# EasyEDA Pro project STC电调.epro

# Schematic v1.0
Board Name: am32ai8051u; Create Date: 2026-01-19; Page Name: P1; Project Name: STC电调(AM32固件移植); Schematic Name: v1.0; Update Date: 2026-01-19; Company: 嘉立创EDA; Page Size: A4; Version: V1.0
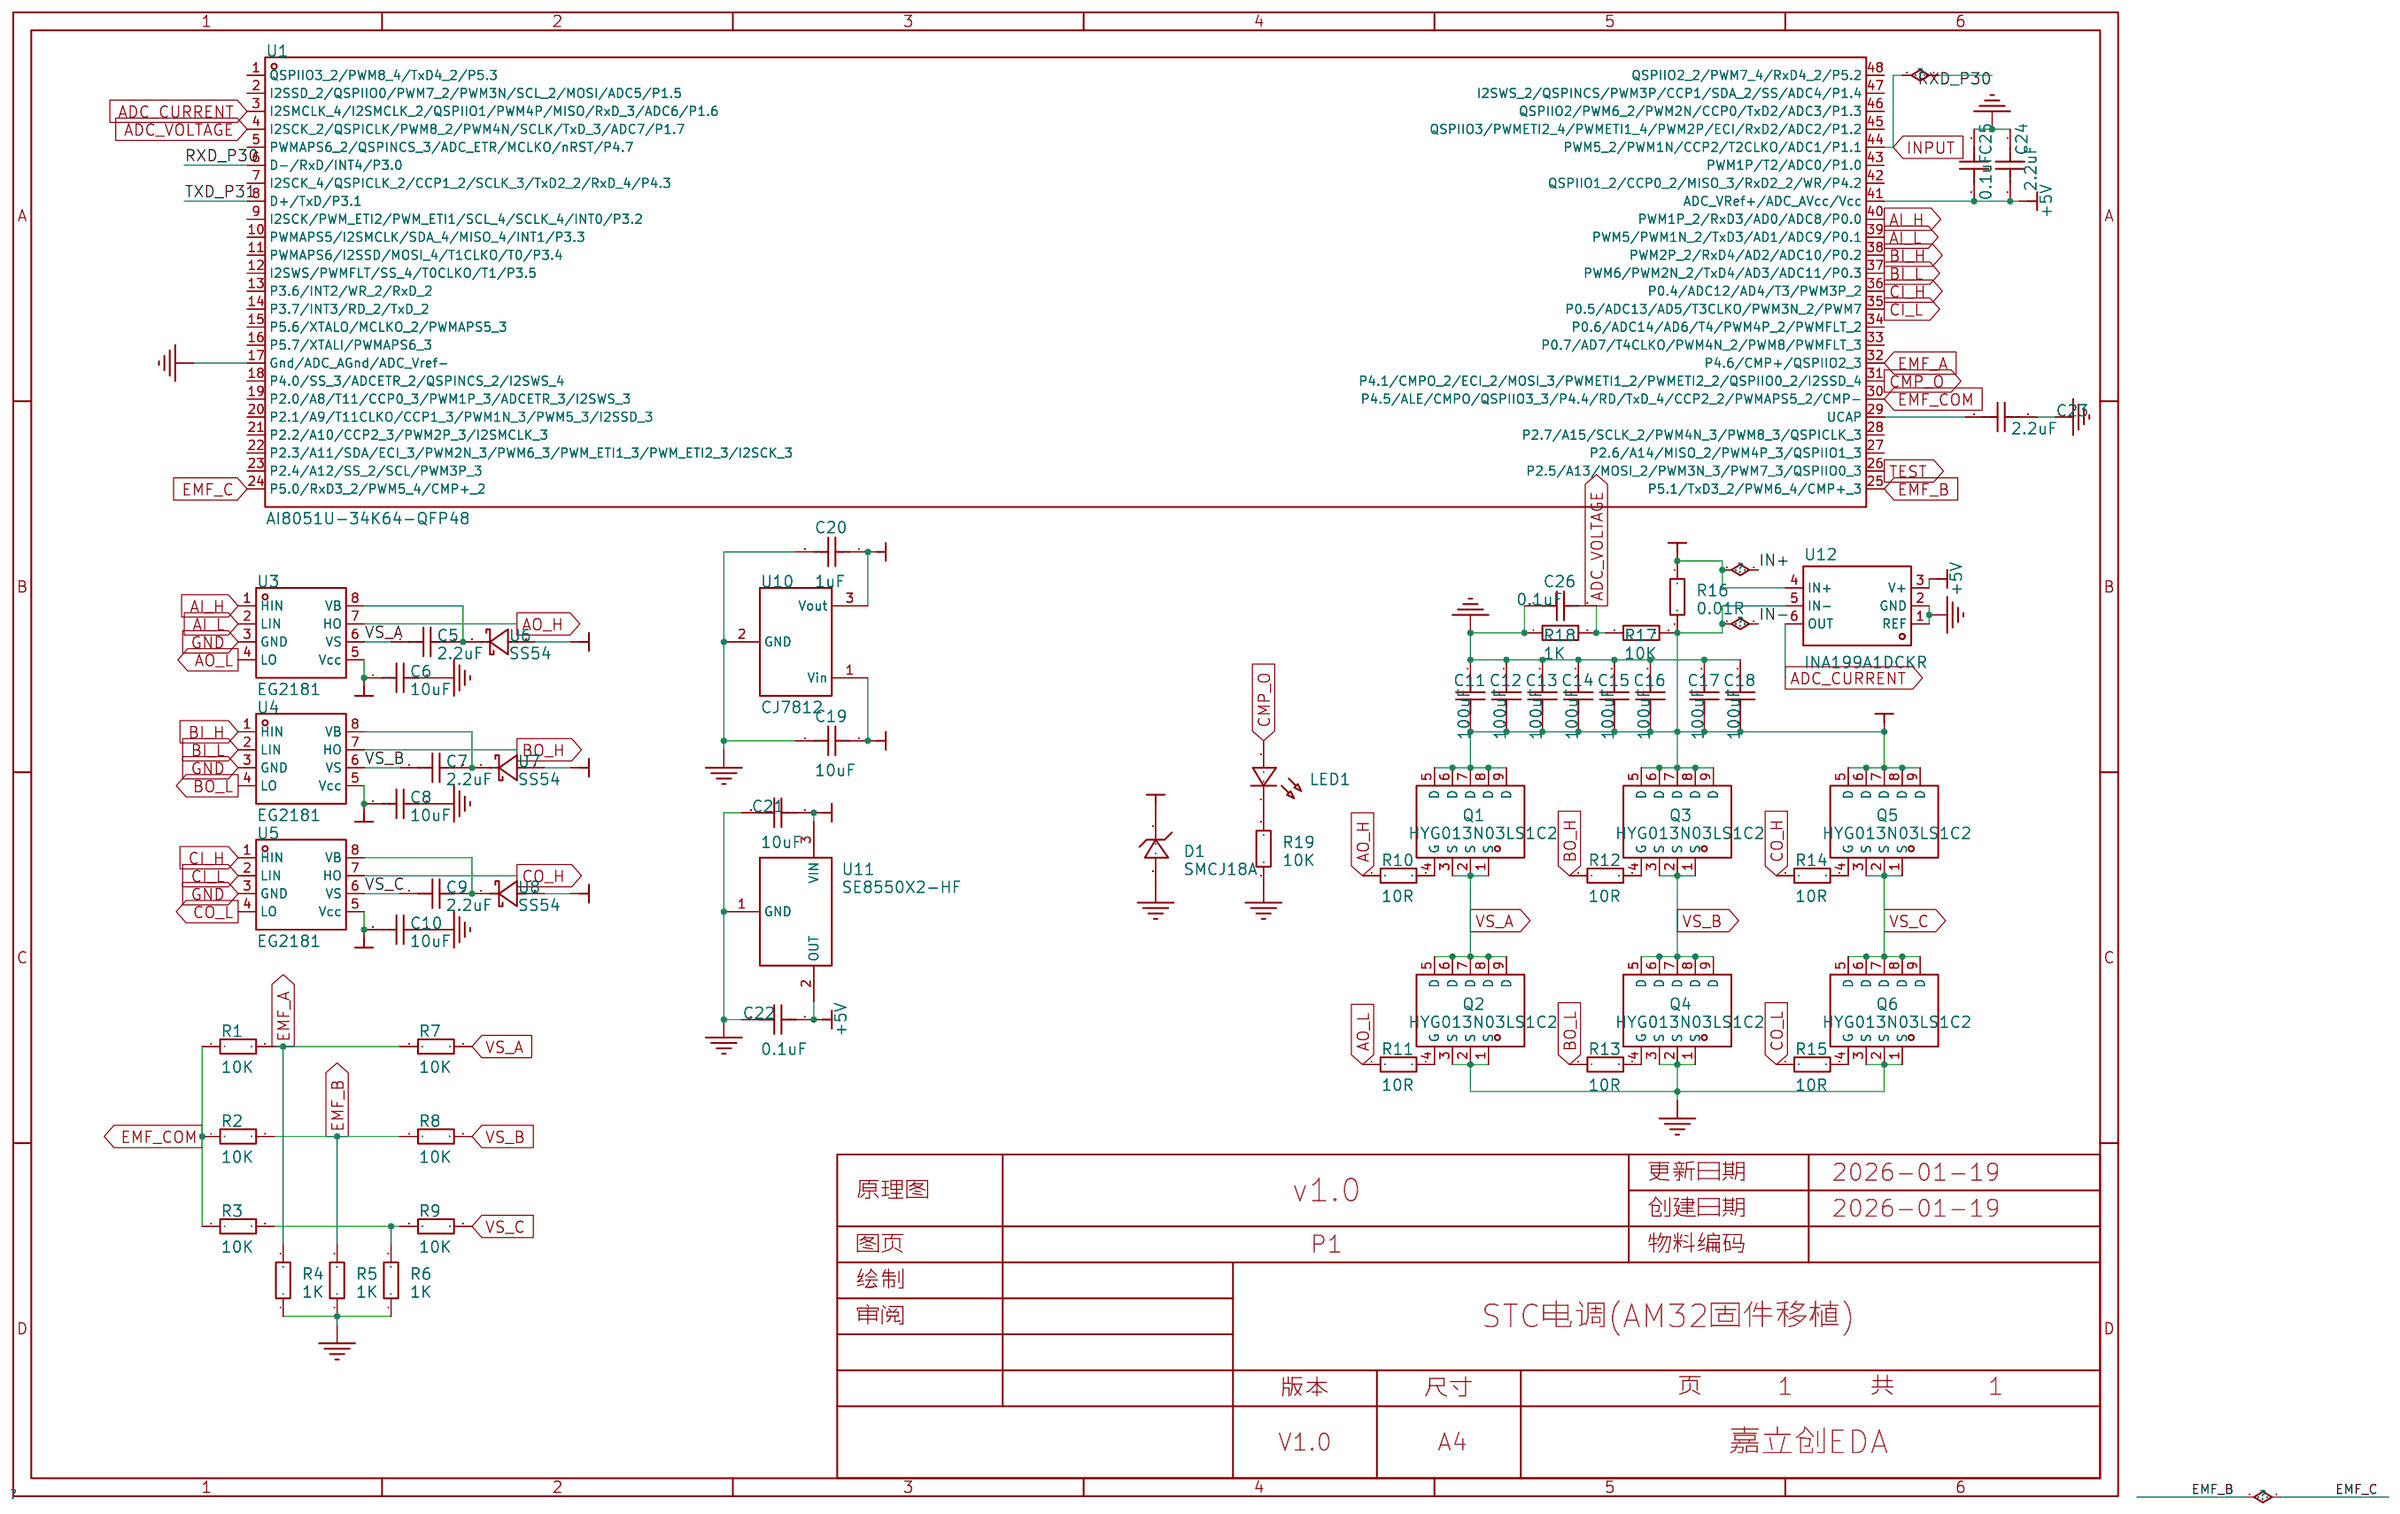
[diagram p0: schematic sheet]

## Parts
C5  2.2uF  [C0603]
C6  10uF  [C0603]
C7  2.2uF  [C0603]
C8  10uF  [C0603]
C9  2.2uF  [C0603]
C10  10uF  [C0603]
C11  100uF  [C1206]
C12  100uF  [C1206]
C13  100uF  [C1206]
C14  100uF  [C1206]
C15  100uF  [C1206]
C16  100uF  [C1206]
C17  100uF  [C1206]
C18  100uF  [C1206]
C19  10uF  [C0603]
C20  1uF  [C0603]
C21  10uF  [C0603]
C22  0.1uF  [C0603]
C23  2.2uF  [C0603]
C24  2.2uF  [C0603]
C25  0.1uF  [C0603]
C26  0.1uF  [C0603]
D1  SMCJ18A  [SMC_L6.9-W5.9-LS7.9-RD]
LED1  -  [LED_0603]
Q1  HYG013N03LS1C2  [PDFN-8_L5.8-W5.1-P1.27-LS6.1-BL]
Q2  HYG013N03LS1C2  [PDFN-8_L5.8-W5.1-P1.27-LS6.1-BL]
Q3  HYG013N03LS1C2  [PDFN-8_L5.8-W5.1-P1.27-LS6.1-BL]
Q4  HYG013N03LS1C2  [PDFN-8_L5.8-W5.1-P1.27-LS6.1-BL]
Q5  HYG013N03LS1C2  [PDFN-8_L5.8-W5.1-P1.27-LS6.1-BL]
Q6  HYG013N03LS1C2  [PDFN-8_L5.8-W5.1-P1.27-LS6.1-BL]
R1  10K  [R0603]
R2  10K  [R0603]
R3  10K  [R0603]
R4  1K  [R0603]
R5  1K  [R0603]
R6  1K  [R0603]
R7  10K  [R0603]
R8  10K  [R0603]
R9  10K  [R0603]
R10  10R  [R0603]
R11  10R  [R0603]
R12  10R  [R0603]
R13  10R  [R0603]
R14  10R  [R0603]
R15  10R  [R0603]
R16  0.01R  [R2010]
R17  10K  [R0603]
R18  1K  [R0603]
R19  10K  [R0603]
U1  AI8051U-34K64-QFP48  [LQFP-48_L7.0-W7.0-P0.50-LS9.0-BL_1]
U3  EG2181  [SOP-8_L4.9-W3.9-P1.27-LS6.0-BL]
U4  EG2181  [SOP-8_L4.9-W3.9-P1.27-LS6.0-BL]
U5  EG2181  [SOP-8_L4.9-W3.9-P1.27-LS6.0-BL]
U6  SS54  [SMA_L4.2-W2.6-LS5.1-RD]
U7  SS54  [SMA_L4.2-W2.6-LS5.1-RD]
U8  SS54  [SMA_L4.2-W2.6-LS5.1-RD]
U10  CJ7812  [TO-252-3_L6.5-W5.8-P4.58-BL]
U11  SE8550X2-HF  [SOT-23-3_L2.9-W1.3-P1.90-LS2.4-BR]
U12  INA199A1DCKR  [SC-70-6_L2.2-W1.3-P0.65-LS2.1-BR]

## Library data of the parts
C5-C10 C19-C26 = CAP_0603: Supplier Footprint: 0603
C11-C18 = CAP_1206: Supplier Footprint: 1206
D1 = SMCJ18A: LCSC Part Name: TVS 18V截止 51.4A峰值脉冲; Supplier Part: C374030; Manufacturer: Littelfuse(美国力特); Supplier Footprint: DO-214AB(SMCJ); JLCPCB Part Class: 扩展库; Datasheet: https://atta.szlcsc.com/upload/public/pdf/source/20190918/C428836_E6B4B3834ADA1E56164A3D12F904E6C7.pdf; Supplier: LCSC; polarity: 单向; Reverse Stand-Off Voltage (Vrwm): 18V; Maximum Clamping Voltage: 29.2V; Peak Pulse Current (Ipp): 51.4A; Peak Pulse Power Dissipation (Ppp): 1.5kW; Breakdown Voltage: 20V; Type: TVS
LED1 = LED_0603-R: Supplier Footprint: 0603
Q1-Q6 = HYG013N03LS1C2: LCSC Part Name: 单通道N沟道MOSFET,电流:150A,耐压:30V; Supplier Part: C2763405; Manufacturer: HUAYI(华羿微); Supplier Footprint: PDFN-8(5.1x5.8); JLCPCB Part Class: 扩展库; Datasheet: https://atta.szlcsc.com/upload/public/pdf/source/20210326/C2763405_0A6080D7BBB9C26F30CE39A27C6AD564.pdf; Supplier: LCSC; Drain Source Voltage (Vdss): 30V; Continuous Drain Current (Id): 150A; Drain Source On Resistance (RDS(on)@Vgs,Id): 2mΩ@4.5V,20A; Power Dissipation (Pd): 65W; Gate Threshold Voltage (Vgs(th)@Id): 1V@250uA; Total Gate Charge (Qg@Vgs): 44.7nC@10V; Input Capacitance (Ciss@Vds): 3.011nF; Reverse Transfer Capacitance (Crss@Vds): 9.2pF@25V; Operating Temperature: -55℃~+175℃
R1-R15 R17-R19 = Res_0603: Supplier Footprint: 0603
R16 = Res_2010: Supplier Footprint: 2010
U1 = AI8051U-34K64-QFP48: Supplier Part: C41427635; Manufacturer: STC; Supplier Footprint: QFP-48; JLCPCB Part Class: 扩展库; Datasheet: https://atta.szlcsc.com/upload/public/pdf/source/20241012/98E0A3F17C9CC280218AE3F266CCDE47.pdf; Supplier: LCSC
U3-U5 = EG2181: Supplier Part: C459721; Manufacturer: EG(屹晶微); Supplier Footprint: SOP-8; JLCPCB Part Class: 扩展库; Datasheet: https://atta.szlcsc.com/upload/public/pdf/source/20191122/C459721_8DDE7F395482F041919AB19A4C4FD510.pdf; Supplier: LCSC
U6-U8 = SS54: Supplier Part: C9900023219; Supplier Footprint: (1N5824)DO-214; JLCPCB Part Class: 扩展库; Supplier: LCSC
U10 = CJ7812_C26184: LCSC Part Name: 输入35V 输出12V 1.5A; Supplier Part: C26184; Manufacturer: CJ(江苏长电/长晶); Supplier Footprint: TO-252-2; JLCPCB Part Class: 扩展库; Datasheet: https://atta.szlcsc.com/upload/public/pdf/source/20180412/C26184_C7F45D4504ECDF2F14935BA96F015906.pdf; Supplier: LCSC; Output Type: 固定; Maximum Input Voltage: 35V; Output Voltage: 12V; Output Current: 1.5A; Dropout Voltage: 2V@(1A); Output Polarity: 正极; Number of Outputs: 1
U11 = SE8550X2-HF: LCSC Part Name: 输入40V 输出5V 250mA; Supplier Part: C115015; Manufacturer: SEAWARD(思旺); Supplier Footprint: SOT-23; JLCPCB Part Class: 扩展库; Datasheet: https://atta.szlcsc.com/upload/public/pdf/source/20221228/060EFB5038ABEFFCA582915343CD15E2.pdf; Supplier: LCSC; Output Type: 固定; Maximum Input Voltage: 40V; Output Voltage: 5V; MAX Output Current: 250mA; Power Supply Rejection Ratio (PSRR): 85dB; Dropout Voltage: 600mV@(200mA); standby current: 2uA; Output Polarity: 正极; Number of Outputs: 1
U12 = INA199A1DCKR: Supplier Part: C59135; Manufacturer: TI(德州仪器); Supplier Footprint: SOT-363(SC-70-6); JLCPCB Part Class: 扩展库; Datasheet: https://www.ti.com/cn/lit/gpn/ina199; Supplier: LCSC; Supply Voltage: -300mV~26V; Supply Current: 300uA; Operating Temperature: -40℃~+125℃

## Nets
+5V: C22.2 C24.2 C25.2 U1.41(ADC_VRef+/ADC_AVcc/Vcc) U11.2(OUT) U12.3(V+)
+12V: C6.1 C8.1 C10.1 C20.1 C21.1 U3.5(Vcc) U4.5(Vcc) U5.5(Vcc) U6.2(A) U7.2(A) U8.2(A) U10.3(Vout) U11.3(VIN)
GND: C6.2 C8.2 C10.2 C11.2 C12.2 C13.2 C14.2 C15.2 C16.2 C17.2 C18.2 C19.2 C20.2 C21.2 C22.1 C23.1 C24.1 C25.1 C26.1 D1.2(A) Q2.1(S) Q2.2(S) Q2.3(S) Q4.1(S) Q4.2(S) Q4.3(S) Q6.1(S) Q6.2(S) Q6.3(S) R4.1 R5.1 R6.1 R18.1 R19.1 U1.17(Gnd/ADC_AGnd/ADC_Vref-) U3.3(GND) U4.3(GND) U5.3(GND) U10.2(GND) U11.1(GND) U12.1(REF) U12.2(GND)
VBAT: C19.1 R16.1 U10.1(Vin) U12.4(IN+)
ADC_CURRENT: U1.3(I2SMCLK_4/I2SMCLK_2/QSPIIO1/PWM4P/MISO/RxD_3/ADC6/P1.6) U12.6(OUT)
ADC_VOLTAGE: C26.2 R17.1 R18.2 U1.4(I2SCK_2/QSPICLK/PWM8_2/PWM4N/SCLK/TxD_3/ADC7/P1.7)
AI_H: U1.40(PWM1P_2/RxD3/AD0/ADC8/P0.0) U3.1(HIN)
AI_L: U1.39(PWM5/PWM1N_2/TxD3/AD1/ADC9/P0.1) U3.2(LIN)
AO_H: R10.1 U3.7(HO)
AO_L: R11.1 U3.4(LO)
BI_H: U1.38(PWM2P_2/RxD4/AD2/ADC10/P0.2) U4.1(HIN)
BI_L: U1.37(PWM6/PWM2N_2/TxD4/AD3/ADC11/P0.3) U4.2(LIN)
BO_H: R12.1 U4.7(HO)
BO_L: R13.1 U4.4(LO)
CI_H: U1.36(P0.4/ADC12/AD4/T3/PWM3P_2) U5.1(HIN)
CI_L: U1.35(P0.5/ADC13/AD5/T3CLKO/PWM3N_2/PWM7) U5.2(LIN)
CMP_O: LED1.2(A) U1.31(P4.1/CMPO_2/ECI_2/MOSI_3/PWMETI1_2/PWMETI2_2/QSPIIO0_2/I2SSD_4)
CO_H: R14.1 U5.7(HO)
CO_L: R15.1 U5.4(LO)
EMF_A: R1.2 R4.2 R7.1 U1.32(P4.6/CMP+/QSPIIO2_3)
EMF_B: R2.2 R3.2 R5.2 R6.2 R8.1 R9.1 U1.24(P5.0/RxD3_2/PWM5_4/CMP+_2) U1.25(P5.1/TxD3_2/PWM6_4/CMP+_3)
EMF_COM: R1.1 R2.1 R3.1 U1.30(P4.5/ALE/CMPO/QSPIIO3_3/P4.4/RD/TxD_4/CCP2_2/PWMAPS5_2/CMP-)
INPUT: U1.6(D-/RxD/INT4/P3.0) U1.44(PWM5_2/PWM1N/CCP2/T2CLKO/ADC1/P1.1)
TEST: U1.26(P2.5/A13/MOSI_2/PWM3N_3/PWM7_3/QSPIIO0_3)
TXD_P31: U1.8(D+/TxD/P3.1)
V_MOS: C11.1 C12.1 C13.1 C14.1 C15.1 C16.1 C17.1 C18.1 D1.1(C) Q1.5(D) Q1.6(D) Q1.7(D) Q1.8(D) Q1.9(D) Q3.5(D) Q3.6(D) Q3.7(D) Q3.8(D) Q3.9(D) Q5.5(D) Q5.6(D) Q5.7(D) Q5.8(D) Q5.9(D) R16.2 R17.2 U12.5(IN-)
VS_A: C5.1 Q1.1(S) Q1.2(S) Q1.3(S) Q2.5(D) Q2.6(D) Q2.7(D) Q2.8(D) Q2.9(D) R7.2 U3.6(VS)
VS_B: C7.1 Q3.1(S) Q3.2(S) Q3.3(S) Q4.5(D) Q4.6(D) Q4.7(D) Q4.8(D) Q4.9(D) R8.2 U4.6(VS)
VS_C: C9.1 Q5.1(S) Q5.2(S) Q5.3(S) Q6.5(D) Q6.6(D) Q6.7(D) Q6.8(D) Q6.9(D) R9.2 U5.6(VS)
$1N3291: Q2.4(G) R11.2
$1N3317: Q4.4(G) R13.2
$1N3367: Q6.4(G) R15.2
$1N3393: Q1.4(G) R10.2
$1N3419: Q3.4(G) R12.2
$1N3445: Q5.4(G) R14.2
$1N6248: C7.2 U4.8(VB) U7.1(C)
$1N6352: C9.2 U5.8(VB) U8.1(C)
$1N7183: C23.2 U1.29(UCAP)
$1N9300: C5.2 U3.8(VB) U6.1(C)
$1N11107: LED1.1(C) R19.2

Not connected (* = marked no-connect by the designer): U1 1(QSPIIO3_2/PWM8_4/TxD4_2/P5.3) 2(I2SSD_2/QSPIIO0/PWM7_2/PWM3N/SCL_2/MOSI/ADC5/P1.5) 5(PWMAPS6_2/QSPINCS_3/ADC_ETR/MCLKO/nRST/P4.7) 7(I2SCK_4/QSPICLK_2/CCP1_2/SCLK_3/TxD2_2/RxD_4/P4.3) 9(I2SCK/PWM_ETI2/PWM_ETI1/SCL_4/SCLK_4/INT0/P3.2) 10(PWMAPS5/I2SMCLK/SDA_4/MISO_4/INT1/P3.3) 11(PWMAPS6/I2SSD/MOSI_4/T1CLKO/T0/P3.4) 12(I2SWS/PWMFLT/SS_4/T0CLKO/T1/P3.5) 13(P3.6/INT2/WR_2/RxD_2) 14(P3.7/INT3/RD_2/TxD_2) 15(P5.6/XTALO/MCLKO_2/PWMAPS5_3) 16(P5.7/XTALI/PWMAPS6_3) 18(P4.0/SS_3/ADCETR_2/QSPINCS_2/I2SWS_4) 19(P2.0/A8/T11/CCP0_3/PWM1P_3/ADCETR_3/I2SWS_3) 20(P2.1/A9/T11CLKO/CCP1_3/PWM1N_3/PWM5_3/I2SSD_3) 21(P2.2/A10/CCP2_3/PWM2P_3/I2SMCLK_3) 22(P2.3/A11/SDA/ECI_3/PWM2N_3/PWM6_3/PWM_ETI1_3/PWM_ETI2_3/I2SCK_3) 23(P2.4/A12/SS_2/SCL/PWM3P_3) 27(P2.6/A14/MISO_2/PWM4P_3/QSPIIO1_3) 28(P2.7/A15/SCLK_2/PWM4N_3/PWM8_3/QSPICLK_3) 33(P0.7/AD7/T4CLKO/PWM4N_2/PWM8/PWMFLT_3) 34(P0.6/ADC14/AD6/T4/PWM4P_2/PWMFLT_2) 42(QSPIIO1_2/CCP0_2/MISO_3/RxD2_2/WR/P4.2) 43(PWM1P/T2/ADC0/P1.0) 45(QSPIIO3/PWMETI2_4/PWMETI1_4/PWM2P/ECI/RxD2/ADC2/P1.2) 46(QSPIIO2/PWM6_2/PWM2N/CCP0/TxD2/ADC3/P1.3) 47(I2SWS_2/QSPINCS/PWM3P/CCP1/SDA_2/SS/ADC4/P1.4) 48(QSPIIO2_2/PWM7_4/RxD4_2/P5.2)

# Board v1.0
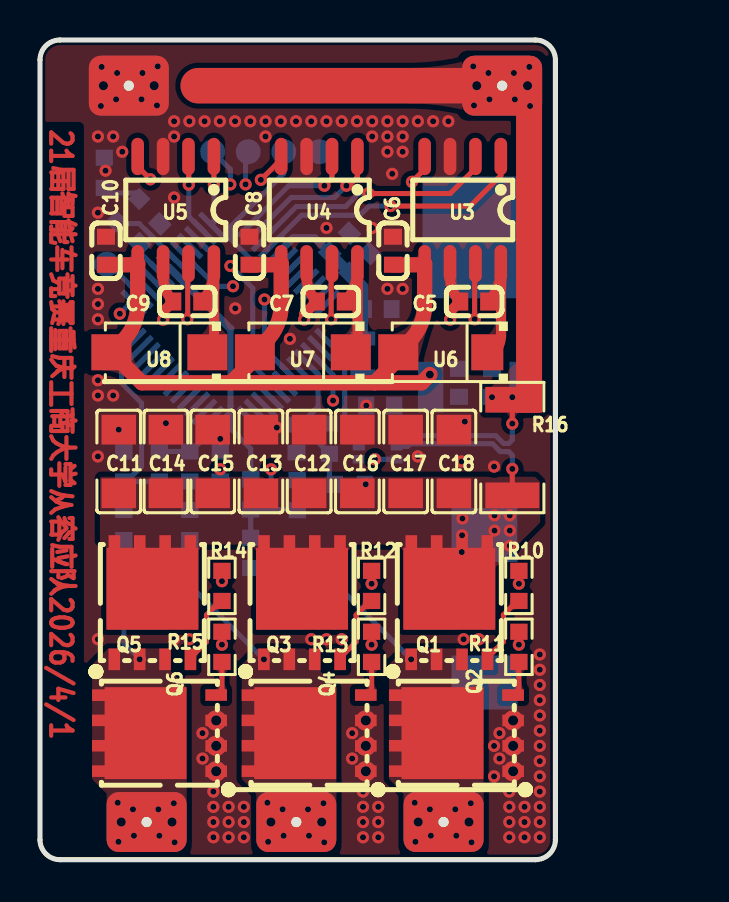
[diagram p1: board, top side]
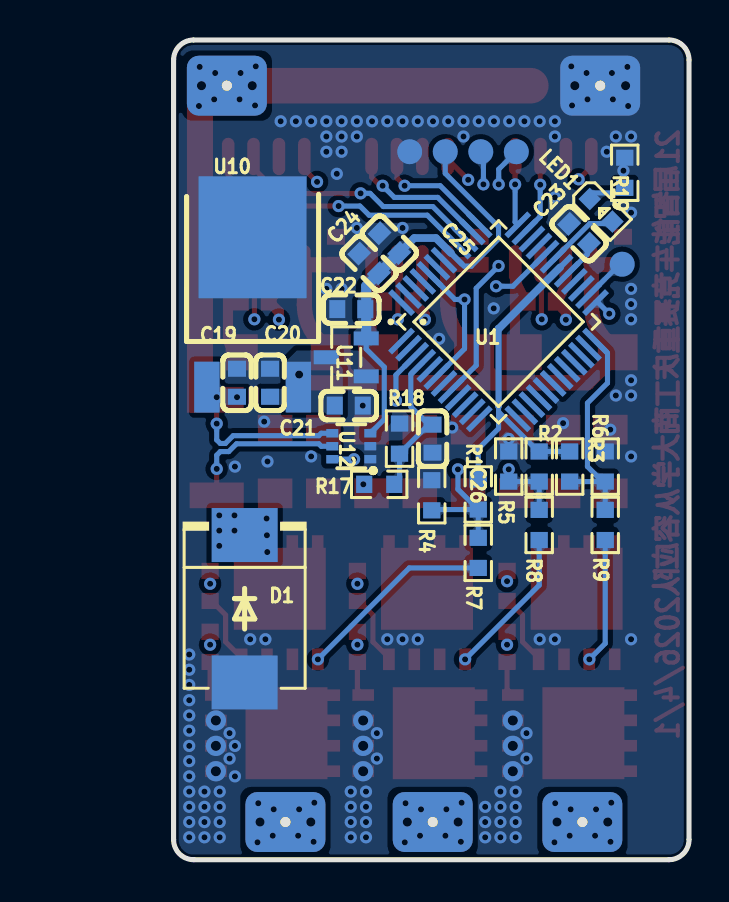
[diagram p2: board, bottom side, seen from below]

Outline 25.78 x 41 mm; copper layers: Top Layer, Inner1, Inner2, Bottom Layer. Coordinates in mm from the lower left corner of the outline.
Outline path: 0,40 0,1 arc(0.29,0.29) 1,0 24.78,0 arc(25.49,0.29) 25.78,1 25.78,40 arc(25.49,40.71) 24.78,41 1,41 arc(0.29,40.71) 0,40
Stack: Top Layer 0.035mm 外层铜厚1oz / Dielectric1 0.2104mm 7628 RC49% 8.6mil / Inner1 0.0152mm 内层铜厚 / Dielectric2 1.065mm 1.1mm H/HOZ Copper / Inner2 0.0152mm 内层铜厚 / Dielectric3 0.2104mm 7628 RC49% 8.6mil / Bottom Layer 0.035mm 外层铜厚1oz

## Design rules (mm)
spacing copperThickness1oz (default): track to track 0.102, other pairs 0.152 to 0.3
spacing copperThickness2oz: track to track 0.203, other pairs 0.152 to 0.3
spacing Plane_innerPlane: track to track 0.102, other pairs 0.152 to 0.3
spacing Copper_copperRegion: track to track 0.102, other pairs 0.152 to 0.3
track width copperThickness1oz (default): min 0.127, default 0.254, max 2.54
track width copperThickness2oz: min 0.203, default 0.254, max 2.54
differential pair differentialPair (default): width min 0.127, default 0.254, max 2.54; gap min 0.152, default 0.152
via viaSize (default): diameter min 0.5, default 0.61, max 10; hole min 0.3, default 0.305, max 6.299
pour e518 uses Copper_copperRegion
pour e520 uses Copper_copperRegion
pour e522 uses Copper_copperRegion
pour e524 uses Copper_copperRegion
pour e526 uses Copper_copperRegion
pour e528 uses Copper_copperRegion
pour e530 uses Copper_copperRegion
pour e532 uses Copper_copperRegion
pour e534 uses Copper_copperRegion
pour e536 uses Copper_copperRegion
pour e538 uses Copper_copperRegion
pour e540 uses Copper_copperRegion
pour e544 uses Copper_copperRegion
pour e546 uses Copper_copperRegion
pour e550 uses Copper_copperRegion

## Placement (name value [footprint] x y rotation side)
C5  2.2uF  [C0603]  21.72 27.92 0 top
C6  10uF  [C0603]  17.65 30.46 90 top
C7  2.2uF  [C0603]  14.54 27.92 0 top
C8  10uF  [C0603]  10.48 30.46 90 top
C9  2.2uF  [C0603]  7.37 27.92 0 top
C10  10uF  [C0603]  3.3 30.46 90 top
C11  100uF  [C1206]  3.94 19.92 90 top
C12  100uF  [C1206]  13.46 19.92 90 top
C13  100uF  [C1206]  11.05 19.92 90 top
C14  100uF  [C1206]  6.3 19.92 90 top
C15  100uF  [C1206]  8.64 19.92 90 top
C16  100uF  [C1206]  15.88 19.92 90 top
C17  100uF  [C1206]  18.29 19.92 90 top
C18  100uF  [C1206]  20.7 19.92 90 top
C19  10uF  [C0603]  22.61 23.85 90 bottom
C20  1uF  [C0603]  20.96 23.85 90 bottom
C21  10uF  [C0603]  17.02 22.71 180 bottom
C22  0.1uF  [C0603]  16.89 27.54 180 bottom
C23  2.2uF  [C0603]  5.5 31.31 225 bottom
C24  2.2uF  [C0603]  16 29.82 225 bottom
C25  0.1uF  [C0603]  14.99 30.84 225 bottom
C26  0.1uF  [C0603]  12.83 21.06 90 bottom
D1  SMCJ18A  [SMC_L6.9-W5.9-LS7.9-RD]  22.22 12.55 270 bottom
LED1  -  [LED_0603]  4.36 32.45 225 bottom
NOREF  -  [Pad_e227]  24.46 30.35 180 top
NOREF#2  -  [Pad_e225]  12.19 35.41 180 top
NOREF#3  -  [Pad_e220]  5.33 1.88 0 top
NOREF#4  -  [Pad_e222]  20.19 1.88 0 top
NOREF#5  -  [Pad_e223]  8.64 35.41 180 top
NOREF#6  -  [Pad_e219]  3.34 29.78 180 top
NOREF#7  -  [Pad_e224]  10.41 35.41 180 top
NOREF#8  -  [Pad_e221]  12.82 1.88 0 top
NOREF#9  -  [Pad_e226]  13.97 35.41 180 top
NOREF#10  -  [Pad_e228]  4.44 38.71 180 top
NOREF#11  -  [Pad_e229]  23.11 38.71 0 top
Q1  HYG013N03LS1C2  [PDFN-8_L5.8-W5.1-P1.27-LS6.1-BL]  20.47 12.86 0 top
Q2  HYG013N03LS1C2  [PDFN-8_L5.8-W5.1-P1.27-LS6.1-BL]  20.83 6.33 90 top
Q3  HYG013N03LS1C2  [PDFN-8_L5.8-W5.1-P1.27-LS6.1-BL]  13.1 12.86 0 top
Q4  HYG013N03LS1C2  [PDFN-8_L5.8-W5.1-P1.27-LS6.1-BL]  13.46 6.33 90 top
Q5  HYG013N03LS1C2  [PDFN-8_L5.8-W5.1-P1.27-LS6.1-BL]  5.62 12.86 0 top
Q6  HYG013N03LS1C2  [PDFN-8_L5.8-W5.1-P1.27-LS6.1-BL]  5.98 6.33 90 top
R1  10K  [R0603]  10.54 18.27 270 bottom
R2  10K  [R0603]  7.49 19.66 270 bottom
R3  10K  [R0603]  5.97 19.66 270 bottom
R4  1K  [R0603]  12.87 18.23 270 bottom
R5  1K  [R0603]  9.02 19.66 270 bottom
R6  1K  [R0603]  4.19 19.66 270 bottom
R7  10K  [R0603]  10.54 15.35 270 bottom
R8  10K  [R0603]  7.49 16.74 270 bottom
R9  10K  [R0603]  4.19 16.74 270 bottom
R10  10R  [R0603]  23.95 13.69 270 top
R11  10R  [R0603]  23.95 10.65 270 top
R12  10R  [R0603]  16.59 13.69 270 top
R13  10R  [R0603]  16.59 10.65 270 top
R14  10R  [R0603]  9.1 13.69 270 top
R15  10R  [R0603]  9.1 10.65 270 top
R16  0.01R  [R2010]  23.62 20.62 270 top
R17  10K  [R0603]  15.49 18.77 0 bottom
R18  1K  [R0603]  14.48 21.06 270 bottom
R19  10K  [R0603]  3.21 34.36 270 bottom
U1  AI8051U-34K64-QFP48  [LQFP-48_L7.0-W7.0-P0.50-LS9.0-BL_1]  9.53 26.9 225 bottom
U3  EG2181  [SOP-8_L4.9-W3.9-P1.27-LS6.0-BL]  21.14 32.49 180 top
U4  EG2181  [SOP-8_L4.9-W3.9-P1.27-LS6.0-BL]  13.97 32.49 180 top
U5  EG2181  [SOP-8_L4.9-W3.9-P1.27-LS6.0-BL]  6.79 32.49 180 top
U6  SS54  [SMA_L4.2-W2.6-LS5.1-RD#2]  20.32 25.38 180 top
U7  SS54  [SMA_L4.2-W2.6-LS5.1-RD]  13.15 25.38 180 top
U8  SS54  [SMA_L4.2-W2.6-LS5.1-RD]  5.97 25.38 180 top
U10  CJ7812  [TO-252-3_L6.5-W5.8-P4.58-BL]  21.82 27.38 180 bottom
U11  SE8550X2-HF  [SOT-23-3_L2.9-W1.3-P1.90-LS2.4-BR]  17.15 25.12 180 bottom
U12  INA199A1DCKR  [SC-70-6_L2.2-W1.3-P0.65-LS2.1-BR]  16.89 20.68 180 bottom

## Footprints (pads in the part's own frame, mm; a bottom-side part is the same pattern mirrored in y, then rotated)
C0603
  rect 0.8x0.9 smd: 1(-0.7,0) 2(0.7,0)
C1206
  rect 1.485x1.728 smd: 1(-1.593,0) 2(1.593,0)
LED_0603
  rect 0.8x0.8 smd: 1(-0.851,-0.01) 2(0.75,-0.005)
LQFP-48_L7.0-W7.0-P0.50-LS9.0-BL_1
  rect 0.28x1.62 smd: 1(-2.75,-4.11) 2(-2.25,-4.11) 3(-1.75,-4.11) 4(-1.25,-4.11) 5(-0.75,-4.11) 6(-0.25,-4.11) 7(0.25,-4.11) 8(0.75,-4.11) 9(1.25,-4.11) 10(1.75,-4.11) 11(2.25,-4.11) 12(2.75,-4.11) 25(2.75,4.11) 26(2.25,4.11) 27(1.75,4.11) 28(1.25,4.11) 29(0.75,4.11) 30(0.25,4.11) 31(-0.25,4.11) 32(-0.75,4.11) 33(-1.25,4.11) 34(-1.75,4.11) 35(-2.25,4.11) 36(-2.75,4.11)
  rect 1.62x0.28 smd: 13(4.11,-2.75) 14(4.11,-2.25) 15(4.11,-1.75) 16(4.11,-1.25) 17(4.11,-0.75) 18(4.11,-0.25) 19(4.11,0.25) 20(4.11,0.75) 21(4.11,1.25) 22(4.11,1.75) 23(4.11,2.25) 24(4.11,2.75) 37(-4.11,2.75) 38(-4.11,2.25) 39(-4.11,1.75) 40(-4.11,1.25) 41(-4.11,0.75) 42(-4.11,0.25) 43(-4.11,-0.25) 44(-4.11,-0.75) 45(-4.11,-1.25) 46(-4.11,-1.75) 47(-4.11,-2.25) 48(-4.11,-2.75)
Pad_e219
  round 1.25 smd far side: 1(0,0)
Pad_e220
  rrect 4x3 hole 0.508: 1(0,0)
Pad_e221
  rrect 4x3 hole 0.508: 1(0,0)
Pad_e222
  rrect 4x3 hole 0.508: 1(0,0)
Pad_e223
  round 1.25 smd far side: 1(0,0)
Pad_e224
  round 1.25 smd far side: 1(0,0)
Pad_e225
  round 1.25 smd far side: 1(0,0)
Pad_e226
  round 1.25 smd far side: 1(0,0)
Pad_e227
  rect 1.3x16 smd: 1(0,0)
Pad_e228
  rrect 4x3 hole 0.508: 1(0,0)
Pad_e229
  rrect 4x3 hole 0.508: 1(0,0)
PDFN-8_L5.8-W5.1-P1.27-LS6.1-BL
  rect 0.58x1.079 smd: 1(-1.905,-2.834) 2(-0.635,-2.834) 3(0.635,-2.834) 4(1.905,-2.834)
  rect 0.58x1.08 smd: 5(1.9,2.834) 6(0.64,2.834) 7(-0.63,2.834) 8(-1.9,2.834)
  rect 4.6x4.1 smd: 9(0,0.695)
R0603
  rect 0.806x0.864 smd: 1(-0.753,0) 2(0.753,0)
R2010
  rect 1.282x2.7 smd: 1(-2.391,0) 2(2.391,0)
SC-70-6_L2.2-W1.3-P0.65-LS2.1-BR
  rect 0.6x0.42 smd: 1(0.95,-0.65) 2(0.95,0) 3(0.95,0.65) 4(-0.95,0.65) 5(-0.95,0) 6(-0.95,-0.65)
SMA_L4.2-W2.6-LS5.1-RD
  rect 2x1.8 smd: 1(-2.4,0) 2(2.4,0)
SMA_L4.2-W2.6-LS5.1-RD#2
  rect 1.6x1.8 smd: 1(-2.051,0)
  rect 2x1.8 smd: 2(2.4,0)
SMC_L6.9-W5.9-LS7.9-RD
  rect 2.7x3.3 smd: 1(-3.687,0) 2(3.687,0)
SOP-8_L4.9-W3.9-P1.27-LS6.0-BL
  oval 0.63x1.865 smd: 1(-1.905,-2.683) 2(-0.635,-2.683) 3(0.635,-2.683) 4(1.905,-2.683) 5(1.905,2.683) 6(0.635,2.683) 7(-0.635,2.683) 8(-1.905,2.683)
SOT-23-3_L2.9-W1.3-P1.90-LS2.4-BR
  rect 1.25x0.7 smd: 1(1,-0.95) 2(1,0.95) 3(-1,0)
TO-252-3_L6.5-W5.8-P4.58-BL
  rect 1.27x2.54 smd: 1(-2.288,-3.747) 3(2.288,-3.745)
  rect 5.4x6.1 smd: 2(-0.002,3.747)

## Nets
+5V: C22.2 C24.2 C25.2 NOREF#2.1 U1.41 U11.2 U12.3
+12V: C6.1 C8.1 C10.1 C20.1 C21.1 U3.5 U4.5 U5.5 U6.2 U7.2 U8.2 U10.3 U11.3
GND: C6.2 C8.2 C10.2 C11.2 C12.2 C13.2 C14.2 C15.2 C16.2 C17.2 C18.2 C19.2 C20.2 C21.2 C22.1 C23.1 C24.1 C25.1 C26.1 D1.2 NOREF#9.1 NOREF#10.1 Q2.1 Q2.2 Q2.3 Q4.1 Q4.2 Q4.3 Q6.1 Q6.2 Q6.3 R4.1 R5.1 R6.1 R18.1 R19.1 U1.17 U3.3 U4.3 U5.3 U10.2 U11.1 U12.1 U12.2
VBAT: C19.1 NOREF.1 NOREF#11.1 R16.1 U10.1 U12.4
ADC_CURRENT: U1.3 U12.6
ADC_VOLTAGE: C26.2 R17.1 R18.2 U1.4
AI_H: U1.40 U3.1
AI_L: U1.39 U3.2
AO_H: R10.1 U3.7
AO_L: R11.1 U3.4
BI_H: U1.38 U4.1
BI_L: U1.37 U4.2
BO_H: R12.1 U4.7
BO_L: R13.1 U4.4
CI_H: U1.36 U5.1
CI_L: U1.35 U5.2
CMP_O: LED1.2 U1.31
CO_H: R14.1 U5.7
CO_L: R15.1 U5.4
EMF_A: R1.2 R4.2 R7.1 U1.32
EMF_B: R2.2 R5.2 R8.1 U1.25
EMF_C: R3.2 R6.2 R9.1 U1.24
EMF_COM: R1.1 R2.1 R3.1 U1.30
INPUT: NOREF#7.1 U1.6 U1.44
TEST: NOREF#6.1 U1.26
TXD_P31: NOREF#5.1 U1.8
V_MOS: C11.1 C12.1 C13.1 C14.1 C15.1 C16.1 C17.1 C18.1 D1.1 Q1.5 Q1.6 Q1.7 Q1.8 Q1.9 Q3.5 Q3.6 Q3.7 Q3.8 Q3.9 Q5.5 Q5.6 Q5.7 Q5.8 Q5.9 R16.2 R17.2 U12.5
VS_A: C5.1 NOREF#4.1 Q1.1 Q1.2 Q1.3 Q2.5 Q2.6 Q2.7 Q2.8 Q2.9 R7.2 U3.6
VS_B: C7.1 NOREF#8.1 Q3.1 Q3.2 Q3.3 Q4.5 Q4.6 Q4.7 Q4.8 Q4.9 R8.2 U4.6
VS_C: C9.1 NOREF#3.1 Q5.1 Q5.2 Q5.3 Q6.5 Q6.6 Q6.7 Q6.8 Q6.9 R9.2 U5.6
$1N3291: Q2.4 R11.2
$1N3317: Q4.4 R13.2
$1N3367: Q6.4 R15.2
$1N3393: Q1.4 R10.2
$1N3419: Q3.4 R12.2
$1N3445: Q5.4 R14.2
$1N6248: C7.2 U4.8 U7.1
$1N6352: C9.2 U5.8 U8.1
$1N7183: C23.2 U1.29
$1N9300: C5.2 U3.8 U6.1
$1N11107: LED1.1 R19.2

Pads without a net: U1 1 2 5 7 9 10 11 12 13 14 15 16 18 19 20 21 22 23 27 28 33 34 42 43 45 46 47 48

## Via types
v1: diameter 0.61, hole 0.305, Top Layer to Bottom Layer, 198 vias
v2: diameter 1.016, hole 0.508, Top Layer to Bottom Layer, 9 vias
v3: diameter 1.016, hole 0.457, Top Layer to Bottom Layer, 10 vias
v4: diameter 0.61, hole 0.4, Top Layer to Bottom Layer, 1 via

## Routing (per net, layer and track width the routed paths; a pad name or vN(x,y) marks a point on that pad's centre or on a via; arc(x,y) is an arc through that point)
+5V: length 22.3
  Bottom Layer w0.254: NOREF#2.1 12.19,34.33 9.53,31.66 9.53,31.05 10.89,29.69 11.25,29.69 U1.41 ; U12.3 15.24,22.03 15.24,24.64 16.15,25.54 U11.2
  Bottom Layer w0.381: 14.49,30.34 13.74,31.09 12.66,31.09 U1.41
  Bottom Layer w0.508: 14.49,30.34 16.15,28.69 U11.2
+12V: length 40.1
  Top Layer w0.762: 17.92,25.26 U6.2 18.49,25.95 arc(19.04,26.78) 19.24,27.75 U3.5 arc(19.18,29.77) 19.12,29.76 17.65,29.76 ; 10.48,29.76 11.95,29.76 arc(12.01,29.77) U4.5 12.06,27.75 arc(11.87,26.78) 11.32,25.95 U7.2 10.91,25.22 9.55,23.85 ; 16.73,23.85 17.92,25.05 ; 16.73,23.85 9.55,23.85 ; 16.73,23.85 19.09,23.85 v4(19.5,24.27) ; 9.55,23.85 5.09,23.85 U8.2 4.14,25.95 arc(4.69,26.78) 4.89,27.75 U5.5 arc(4.83,29.77) 4.77,29.76 3.3,29.76
GND:
  vias: v1(2.9,36.17) v1(2.9,32.36) v1(2.9,28.55) v1(2.9,27.79) v1(2.9,27.03) v1(2.9,23.98) v1(2.9,23.22) v1(2.9,20.17) v1(2.9,11.03) v1(3.04,37.7) v1(3.08,39.65) v1(3.28,34.46) v1(3.66,36.17) v1(3.66,23.22) v1(3.86,39.35) v1(3.81,38.03) v1(3.94,21.51) v1(4.12,35.41) v1(5.13,39.35) v1(5.08,38.03) v1(5.85,37.73) v1(5.89,39.68) v1(6.3,21.83) v1(6.71,36.93) v1(6.71,36.17) v1(6.71,33.12) v1(6.71,11.03) v1(7.47,36.93) v1(7.47,11.03) v1(8.13,6.33) v1(8.13,5.06) v1(8.23,36.93) v1(8.67,3.41) v1(8.67,2.64) v1(8.67,1.88) v1(8.67,1.12) v1(8.99,36.93) v1(9.02,21.05) v1(9.43,3.41) v1(9.43,2.64) v1(9.43,1.88) v1(9.43,1.12) v1(9.76,36.93) v1(9.77,27.58) v1(10.19,2.64) v1(10.19,1.88) v1(10.19,1.12) v1(10.52,36.93) v1(11.28,36.93) v1(11.28,36.17) v1(11.84,21.61) v1(12.04,36.93) v1(12.5,26.05) v1(12.8,36.93) v1(13.57,36.93) v1(13.57,11.03) v1(14.33,36.93) v1(14.33,31.6) v1(14.33,11.03) v1(15.09,36.93) v1(15.09,11.03) v1(15.61,6.33) v1(15.61,5.06) v1(15.85,36.93) v1(16.16,3.41) v1(16.16,2.64) v1(16.16,1.88) v1(16.16,1.12) v1(16.32,22.71) v1(16.61,36.93) v1(16.61,36.17) v1(16.61,31.6) v1(16.92,3.41) v1(16.92,2.64) v1(16.92,1.88) v1(16.92,1.12) v1(17.38,36.93) v1(17.38,36.17) v1(17.38,35.41) v1(17.38,28.55) v1(17.62,34.31) v1(18.14,36.93) v1(18.14,36.17) v1(18.14,35.41) v1(18.14,28.55) v1(18.9,36.93) v1(18.9,20.17) v1(19.66,36.93) v1(20.42,36.93) v1(21.08,19.92) v1(21.25,21.91) v1(21.19,11.03) v1(21.95,11.03) v1(22.71,19.66) v1(22.71,5.69) v1(22.71,4.17) v1(22.98,6.33) v1(22.98,5.06) v1(23.47,3.41) v1(23.47,2.64) v1(23.47,1.88) v1(23.47,1.12) v1(24.23,3.41) v1(24.23,2.64) v1(24.23,1.88) v1(24.23,1.12) v1(25,10.26) v1(25,9.5) v1(25,8.74) v1(25,7.98) v1(25,7.22) v1(25,6.45) v1(25,5.69) v1(25,4.93) v1(25,4.17) v1(25,3.41) v1(25,2.64) v1(25,1.88) v1(25,1.12) v2(8.81,6.96) v2(8.81,5.69) v2(8.81,4.42) v2(16.3,6.96) v2(16.3,5.69) v2(16.3,4.42) v2(23.66,6.96) v2(23.66,5.69) v2(23.66,4.42) v3(3.17,38.71) v3(5.71,38.71)
VBAT: length 23.4
  Top Layer w0.254: v1(23.62,23.13) v1(23.62,21.81)
  Top Layer w1.524: v3(21.84,38.71) NOREF#11.1
  Top Layer w1.778: 7.91,38.71 v3(21.84,38.71)
  Bottom Layer w0.254: v1(23.62,21.81) 23.62,21 23.44,20.82 23.19,20.82 22.8,21.21 18.52,21.21 18.4,21.33 U12.4
  vias: v1(21.67,39.68) v1(21.71,37.73) v1(22.43,39.35) v1(22.48,38.03) v1(22.61,23.13) v1(23.7,39.35) v1(23.75,38.03) v1(24.47,39.65) v1(24.51,37.7) v3(24.38,38.71)
ADC_CURRENT: length 7.6
  Inner2 w0.381: v1(14.66,22.97) 14.66,22.12 v1(16.75,20.03)
  Bottom Layer w0.254: v1(14.66,22.97) 14.66,24.25 U1.3 ; U12.6 v1(16.75,20.03)
ADC_VOLTAGE: length 7.6
  Bottom Layer w0.254: 13.02,21.76 C26.2 ; 13.02,21.76 13.02,21.76 R18.2 14.48,19.04 R17.1 ; 13.02,21.76 13.91,22.65 13.91,24.28 U1.4
AI_H: length 13.9
  Top Layer w0.254: U3.1 23.05,34.22 21.52,32.69 v1(17.53,32.69)
  Bottom Layer w0.254: 11.55,30.69 13.09,32.24 16,32.24 16.46,32.69 v1(17.53,32.69)
AI_L: length 12.6
  Top Layer w0.254: v1(16.43,33.33) 16.44,33.32 20.51,33.32 21.78,34.58 U3.2
  Bottom Layer w0.254: U1.39 12.82,32.67 15.29,32.67 15.95,33.33 v1(16.43,33.33)
AO_H: length 17.6
  Top Layer w0.254: v1(21.74,27.03) 21.74,29.77 U3.7 ; R10.1 v1(23.95,13.8)
  Inner2 w0.381: v1(21.74,27.03) 21.96,26.81 21.96,15.8 v1(23.95,13.8)
AO_L: length 28.1
  Top Layer w0.254: U3.4 19.24,34.54 v1(18.6,33.9) ; v1(23.95,10.75) R11.1
  Inner2 w0.381: v1(23.95,10.75) 24.6,11.4 24.6,25.08 18.6,31.08 v1(18.6,33.9)
BI_H: length 7.2
  Top Layer w0.254: 15.87,35.17 15.87,34.14 15.44,33.71 v1(15.32,33.71)
  Bottom Layer w0.254: v1(15.32,33.71) 14.74,33.13 12.57,33.13 U1.38
BI_L: length 6.2
  Top Layer w0.254: v1(14.22,33.71) 14.6,34.09 14.6,35.17
  Bottom Layer w0.254: v1(14.22,33.71) 12.44,33.71 U1.37
BO_H: length 18
  Top Layer w0.254: v1(14.56,27.03) 14.56,29.77 14.6,29.81 ; R12.1 v1(16.59,13.8)
  Inner2 w0.381: v1(16.59,13.8) 14.01,16.38 14.01,26.48 v1(14.56,27.03)
BO_L: length 29
  Top Layer w0.254: 12.06,35.17 12.06,34.9 11.94,34.9 v1(11.04,34.01) ; v1(16.59,10.75) R13.1
  Inner2 w0.381: v1(16.59,10.75) 17.95,12.11 17.95,25.21 11.04,32.11 v1(11.04,34.01)
CI_H: length 3.5
  Top Layer w0.254: 8.7,33.78 U5.1
  Bottom Layer w0.254: U1.36 8.7,31.89 8.7,33.78
  vias: v1(8.7,33.78)
CI_L: length 4.1
  Top Layer w0.254: U5.2 7.44,35.16 v1(7.44,33.76)
  Bottom Layer w0.254: U1.35 7.44,32.17 v1(7.44,33.76)
CMP_O: length 3.6
  Bottom Layer w0.254: 4.01,31.87 4.07,31.82 4.96,31.82 6.79,29.99
CO_H: length 17.1
  Top Layer w0.254: R14.1 v1(9.1,13.93) ; v1(7.37,27.03) 7.39,27.05 7.39,29.77 U5.7
  Inner2 w0.381: v1(7.37,27.03) 7.38,27.02 7.38,15.65 v1(9.1,13.93)
CO_L: length 27.6
  Top Layer w0.254: v1(5.52,34.03) 4.89,34.67 U5.4 ; v1(9.1,10.75) R15.1
  Inner2 w0.381: v1(5.52,34.03) 5.52,30.91 10.03,26.39 10.03,11.69 v1(9.1,10.75)
EMF_A: length 19.3
  Inner2 w0.381: v1(11.56,19.52) 10.96,20.12 10.96,27.37 v1(9.65,28.68)
  Bottom Layer w0.254: v1(9.65,28.68) 8.81,28.68 7.15,30.34 ; v1(11.56,19.52) 11.56,18.53 R1.2 ; R1.2 12.83,17.51 R4.2 ; R1.2 R7.1
EMF_B: length 17.1
  Inner2 w0.381: v1(9.02,19.52) 8.76,19.78 8.75,19.78 8.17,20.37 8.17,27.15 7.56,27.75 4.44,27.75 v1(3.99,27.31)
  Bottom Layer w0.254: U1.25 4.55,27.86 v1(3.99,27.31) ; R8.1 R2.2 R5.2 v1(9.02,19.52)
EMF_C: length 11.3
  Bottom Layer w0.254: 4.33,18.91 R6.2 4.19,17.75 4.44,17.5 ; 4.33,18.91 R3.2 ; 4.33,18.91 5.08,19.66 5.08,22.84 4.08,23.84 4.08,25.34 U1.24
EMF_COM: length 16.7
  Bottom Layer w0.254: R1.1 10.54,20.55 9.53,21.57 9.53,22.4 ; 9.53,22.4 7.54,20.42 R2.1 R3.1 ; 9.53,22.4 9.53,22.66 9.54,22.66
  Bottom Layer w0.305: 9.54,22.66 9.53,22.68 9.53,26.55 9.54,26.56
  Bottom Layer w0.381: U1.30 9.51,26.56 9.54,26.56
INPUT: length 14.5
  Inner2 w0.254: v1(11.23,28.02) 10.28,28.96 10.28,33.76
  Bottom Layer w0.254: 10.28,33.76 10.28,35.28 NOREF#7.1 ; U1.6 11.23,25.55 v1(11.23,28.02) 11.7,28.02 12.96,29.28
  vias: v1(10.28,33.78)
TEST: length 2.4
  Bottom Layer w0.254: 3.3,29.76 3.49,29.76 U1.26
TXD_P31: length 13.3
  Inner2 w0.254: v1(9.53,29.7) 9.53,33.77 v1(9.52,33.78)
  Bottom Layer w0.254: v1(9.52,33.78) 9.52,34.53 NOREF#5.1 ; v1(9.53,29.7) 10.64,28.58 10.64,24.72 U1.8
V_MOS: length 8.1
  Top Layer w0.254: R16.2 v1(23.62,19.55)
  Bottom Layer w0.254: v1(23.62,19.55) 23.62,20.23 23.44,20.41 23.02,20.41 22.63,20.8 18.52,20.8 18.4,20.68 U12.5
  vias: v1(16.29,18.77) v1(21.13,17.07) v1(21.11,16.23) v1(21.09,15.39) v1(22.73,17.22) v1(22.73,16.46) v1(23.5,17.22) v1(23.5,16.46) v1(23.5,15.7)
VS_A: length 30.9
  Top Layer w0.508: v1(20.51,27.01) 20.51,27.41 21.02,27.92 arc(20.64,28.48) 20.51,29.15 U3.6
  Inner2 w0.508: v1(18.56,10.02) 20.21,11.67 20.21,26.71 v1(20.51,27.01)
  Bottom Layer w0.254: v1(18.56,10.02) 13.99,14.59 R7.2
  vias: v1(18.74,2.85) v1(18.78,0.9) v1(19.5,2.52) v1(19.55,1.2) v1(20.77,2.52) v1(20.82,1.2) v1(21.54,2.82) v1(21.58,0.87) v3(18.91,1.88) v3(21.46,1.88)
VS_B: length 28.5
  Top Layer w0.508: v1(13.21,27.01) 13.21,27.28 C7.1 arc(13.47,28.48) 13.34,29.15 U4.6
  Inner2 w0.508: v1(11.2,10.02) 13.21,12.03 v1(13.21,27.01)
  Bottom Layer w0.254: v1(11.2,10.02) 7.49,13.73 R8.2
  vias: v1(11.37,2.85) v1(11.41,0.9) v1(12.13,2.52) v1(12.18,1.2) v1(13.4,2.52) v1(13.45,1.2) v1(14.18,2.82) v1(14.22,0.87) v3(11.55,1.88) v3(14.09,1.88)
VS_C: length 26.9
  Top Layer w0.508: U5.6 6.16,29.15 arc(6.29,28.48) C9.1 6.16,27.41 v1(6.16,27.01)
  Inner2 w0.508: v1(6.16,27.01) 5.59,26.44 5.59,10.62 v1(4.98,10.02)
  Bottom Layer w0.254: R9.2 4.19,10.82 v1(4.98,10.02)
  vias: v1(3.89,2.85) v1(3.93,0.9) v1(4.65,2.52) v1(4.7,1.2) v1(5.92,2.52) v1(5.97,1.2) v1(6.69,2.82) v1(6.73,0.87) v3(4.06,1.88) v3(6.6,1.88)
$1N3291: length 1.8
  Top Layer w0.254: Q2.4 23.95,8.52 R11.2
$1N3317: length 1.8
  Top Layer w0.254: R13.2 16.59,8.52 Q4.4
$1N3367: length 1.8
  Top Layer w0.254: Q6.4 9.1,8.52 R15.2
$1N3393: length 3.6
  Top Layer w0.254: Q1.4 22.38,10.1 23.18,10.9 23.18,12.24 23.88,12.94 R10.2
$1N3419: length 3.6
  Top Layer w0.254: R12.2 16.51,12.94 15.81,12.24 15.81,10.9 15.01,10.1 Q3.4
$1N3445: length 3.6
  Top Layer w0.254: R14.2 9.03,12.94 8.33,12.24 8.33,10.9 7.53,10.1 Q5.4
$1N6248: length 6.2
  Top Layer w0.508: U4.8 15.88,29.44 ; 15.88,29.44 15.89,29.43 15.89,26.18 15.88,26.17 arc(15.79,25.74) U7.1 ; 15.88,29.44 arc(15.71,28.62) C7.2
$1N6352: length 6.2
  Top Layer w0.508: U5.8 8.7,29.44 ; 8.7,29.44 8.71,29.43 8.71,26.18 8.7,26.17 arc(8.61,25.74) U8.1 ; 8.7,29.44 arc(8.53,28.62) C9.2
$1N7183: length 2
  Bottom Layer w0.254: 5.09,30.85 5.09,30.27 6.09,29.28
$1N9300: length 6.2
  Top Layer w0.508: 23.05,29.44 23.06,29.43 23.06,26.18 23.05,26.17 arc(22.96,25.74) 22.72,25.38 ; 23.05,29.44 U3.8 ; 23.05,29.44 arc(22.88,28.62) C5.2
$1N11107: length 2.3
  Bottom Layer w0.254: 2.96,33.35 4.8,33.35 5.15,33

## Copper pours and planes (outline as drawn; the poured copper is in the pictures)
+12V on Bottom Layer: 20.17,24.91 20.17,23.55 21.41,23.55 20.61,22.76 20.17,22.76 20.17,22.37 18.22,22.36 18.12,22.27 17.32,22.27 17.32,22.26 17.32,24.58 17.52,24.77 17.52,25.47 17.52,25.48 19.61,25.48
GND on Top Layer: 16.84,7.51 15.53,7.51 15.11,7.09 15.11,3.88 16.84,3.88
GND on Top Layer: 9.36,7.51 8.05,7.51 7.63,7.09 7.63,3.88 9.36,3.88
GND on Top Layer: 3.07,20.77 21.56,20.77 21.56,22.25 21.56,22.25 3.07,22.25
GND on Top Layer: 24.21,7.51 22.9,7.51 22.48,7.09 22.48,3.88 24.21,3.88
GND on Top Layer: 0,40 0.02,40.18 0.07,40.37 0.17,40.55 0.29,40.71 0.45,40.83 0.63,40.93 0.82,40.98 1,41 24.78,41 24.95,40.98 25.15,40.93 25.33,40.83 25.49,40.71 25.61,40.55 25.71,40.37 25.76,40.18 25.78,40 25.78,1 25.76,0.82 25.71,0.63 25.61,0.45 25.49,0.29 25.33,0.17 25.15,0.07 24.95,0.02 24.78,0 1,0 0.82,0.02 0.63,0.07 0.45,0.17 0.29,0.29 0.17,0.45 0.07,0.63 0.02,0.82 0,1
GND on Bottom Layer: 0,40 0.02,40.18 0.07,40.37 0.17,40.55 0.29,40.71 0.45,40.83 0.63,40.93 0.82,40.98 1,41 24.78,41 24.95,40.98 25.15,40.93 25.33,40.83 25.49,40.71 25.61,40.55 25.71,40.37 25.76,40.18 25.78,40 25.78,1 25.76,0.82 25.71,0.63 25.61,0.45 25.49,0.29 25.33,0.17 25.15,0.07 24.95,0.02 24.78,0 1,0 0.82,0.02 0.63,0.07 0.45,0.17 0.29,0.29 0.17,0.45 0.07,0.63 0.02,0.82 0,1
GND on Inner1: 1.78,40 1.79,40.18 1.85,40.37 1.94,40.55 2.07,40.71 2.23,40.83 2.41,40.93 2.6,40.98 2.78,41 24.78,41 24.95,40.98 25.15,40.93 25.33,40.83 25.49,40.71 25.61,40.55 25.71,40.37 25.76,40.18 25.78,40 25.78,1 25.76,0.82 25.71,0.63 25.61,0.45 25.49,0.29 25.33,0.17 25.15,0.07 24.95,0.02 24.78,0 2.78,0 2.6,0.02 2.41,0.07 2.23,0.17 2.07,0.29 1.94,0.45 1.85,0.63 1.79,0.82 1.78,1
GND on Inner2: 0,40 0.02,40.18 0.07,40.37 0.17,40.55 0.29,40.71 0.45,40.83 0.63,40.93 0.82,40.98 1,41 24.78,41 24.95,40.98 25.15,40.93 25.33,40.83 25.49,40.71 25.61,40.55 25.71,40.37 25.76,40.18 25.78,40 25.78,1 25.76,0.82 25.71,0.63 25.61,0.45 25.49,0.29 25.33,0.17 25.15,0.07 24.95,0.02 24.78,0 1,0 0.82,0.02 0.63,0.07 0.45,0.17 0.29,0.29 0.17,0.45 0.07,0.63 0.02,0.82 0,1
VBAT on Top Layer: 22.27,22.36 22.27,23.65 22.27,23.65 22.57,23.65 23.76,24.83 25.01,23.58 25.01,22.41 24.97,22.37 22.27,22.37
VBAT on Bottom Layer: 22.16,23.55 23.06,23.55 23.06,23.55 23.36,23.68 23.48,23.98 23.48,24.07 24.69,24.07 24.7,24.06 24.7,22.38 24.68,22.37 23.49,22.37 23.37,22.64 23.1,22.75 22.17,22.75 22.16,22.76 22.16,23.55
V_MOS on Top Layer: 3.32,11.5 3.32,15.61 3,15.93 3,19.1 3.05,19.16 24.76,19.16 25.02,18.9 25.02,16.87 22.77,14.62 22.77,11.51 18.17,11.51 18.17,15.46 17.87,15.76 15.7,15.76 15.4,15.46 15.4,11.51 10.8,11.51 10.8,15.46 10.5,15.76 8.22,15.76 7.92,15.46 7.92,11.51 3.33,11.51
VS_A on Top Layer: 18.18,3.3 17.45,4.03 17.45,9.75 18.27,10.57 21.39,10.57 21.4,10.56 21.4,9.42 22.18,8.63 22.18,4.03 22.19,4.02 22.19,0.87 18.18,0.87
VS_B on Top Layer: 10.81,3.3 10.09,4.03 10.09,9.75 10.9,10.57 14.02,10.57 14.03,10.56 14.03,9.42 14.82,8.63 14.82,4.03 14.82,4.02 14.82,0.87 10.81,0.87
VS_C on Top Layer: 3.33,3.3 2.6,4.03 2.6,9.75 3.42,10.57 6.53,10.57 6.54,10.56 6.54,9.42 7.33,8.63 7.33,4.03 7.34,4.02 7.34,0.87 3.33,0.87

Small or netless copper shapes (teardrops, artwork), in the pictures only: 73 on Top Layer, 75 on Bottom Layer, 22 on Inner2

## Text on the board
Top Layer: 21届智能车竞赛重庆工商大学从容应队2026/4/1
